# Altium schematic sheet Bumblebee.SchDoc
size 431 x 279 mm; SheetNumber: 1; SheetTotal: 1; ENG_APP_DATE: --/--/--; DSN_APP_DATE: --/--/--; CHK_APP_DATE: --/--/--
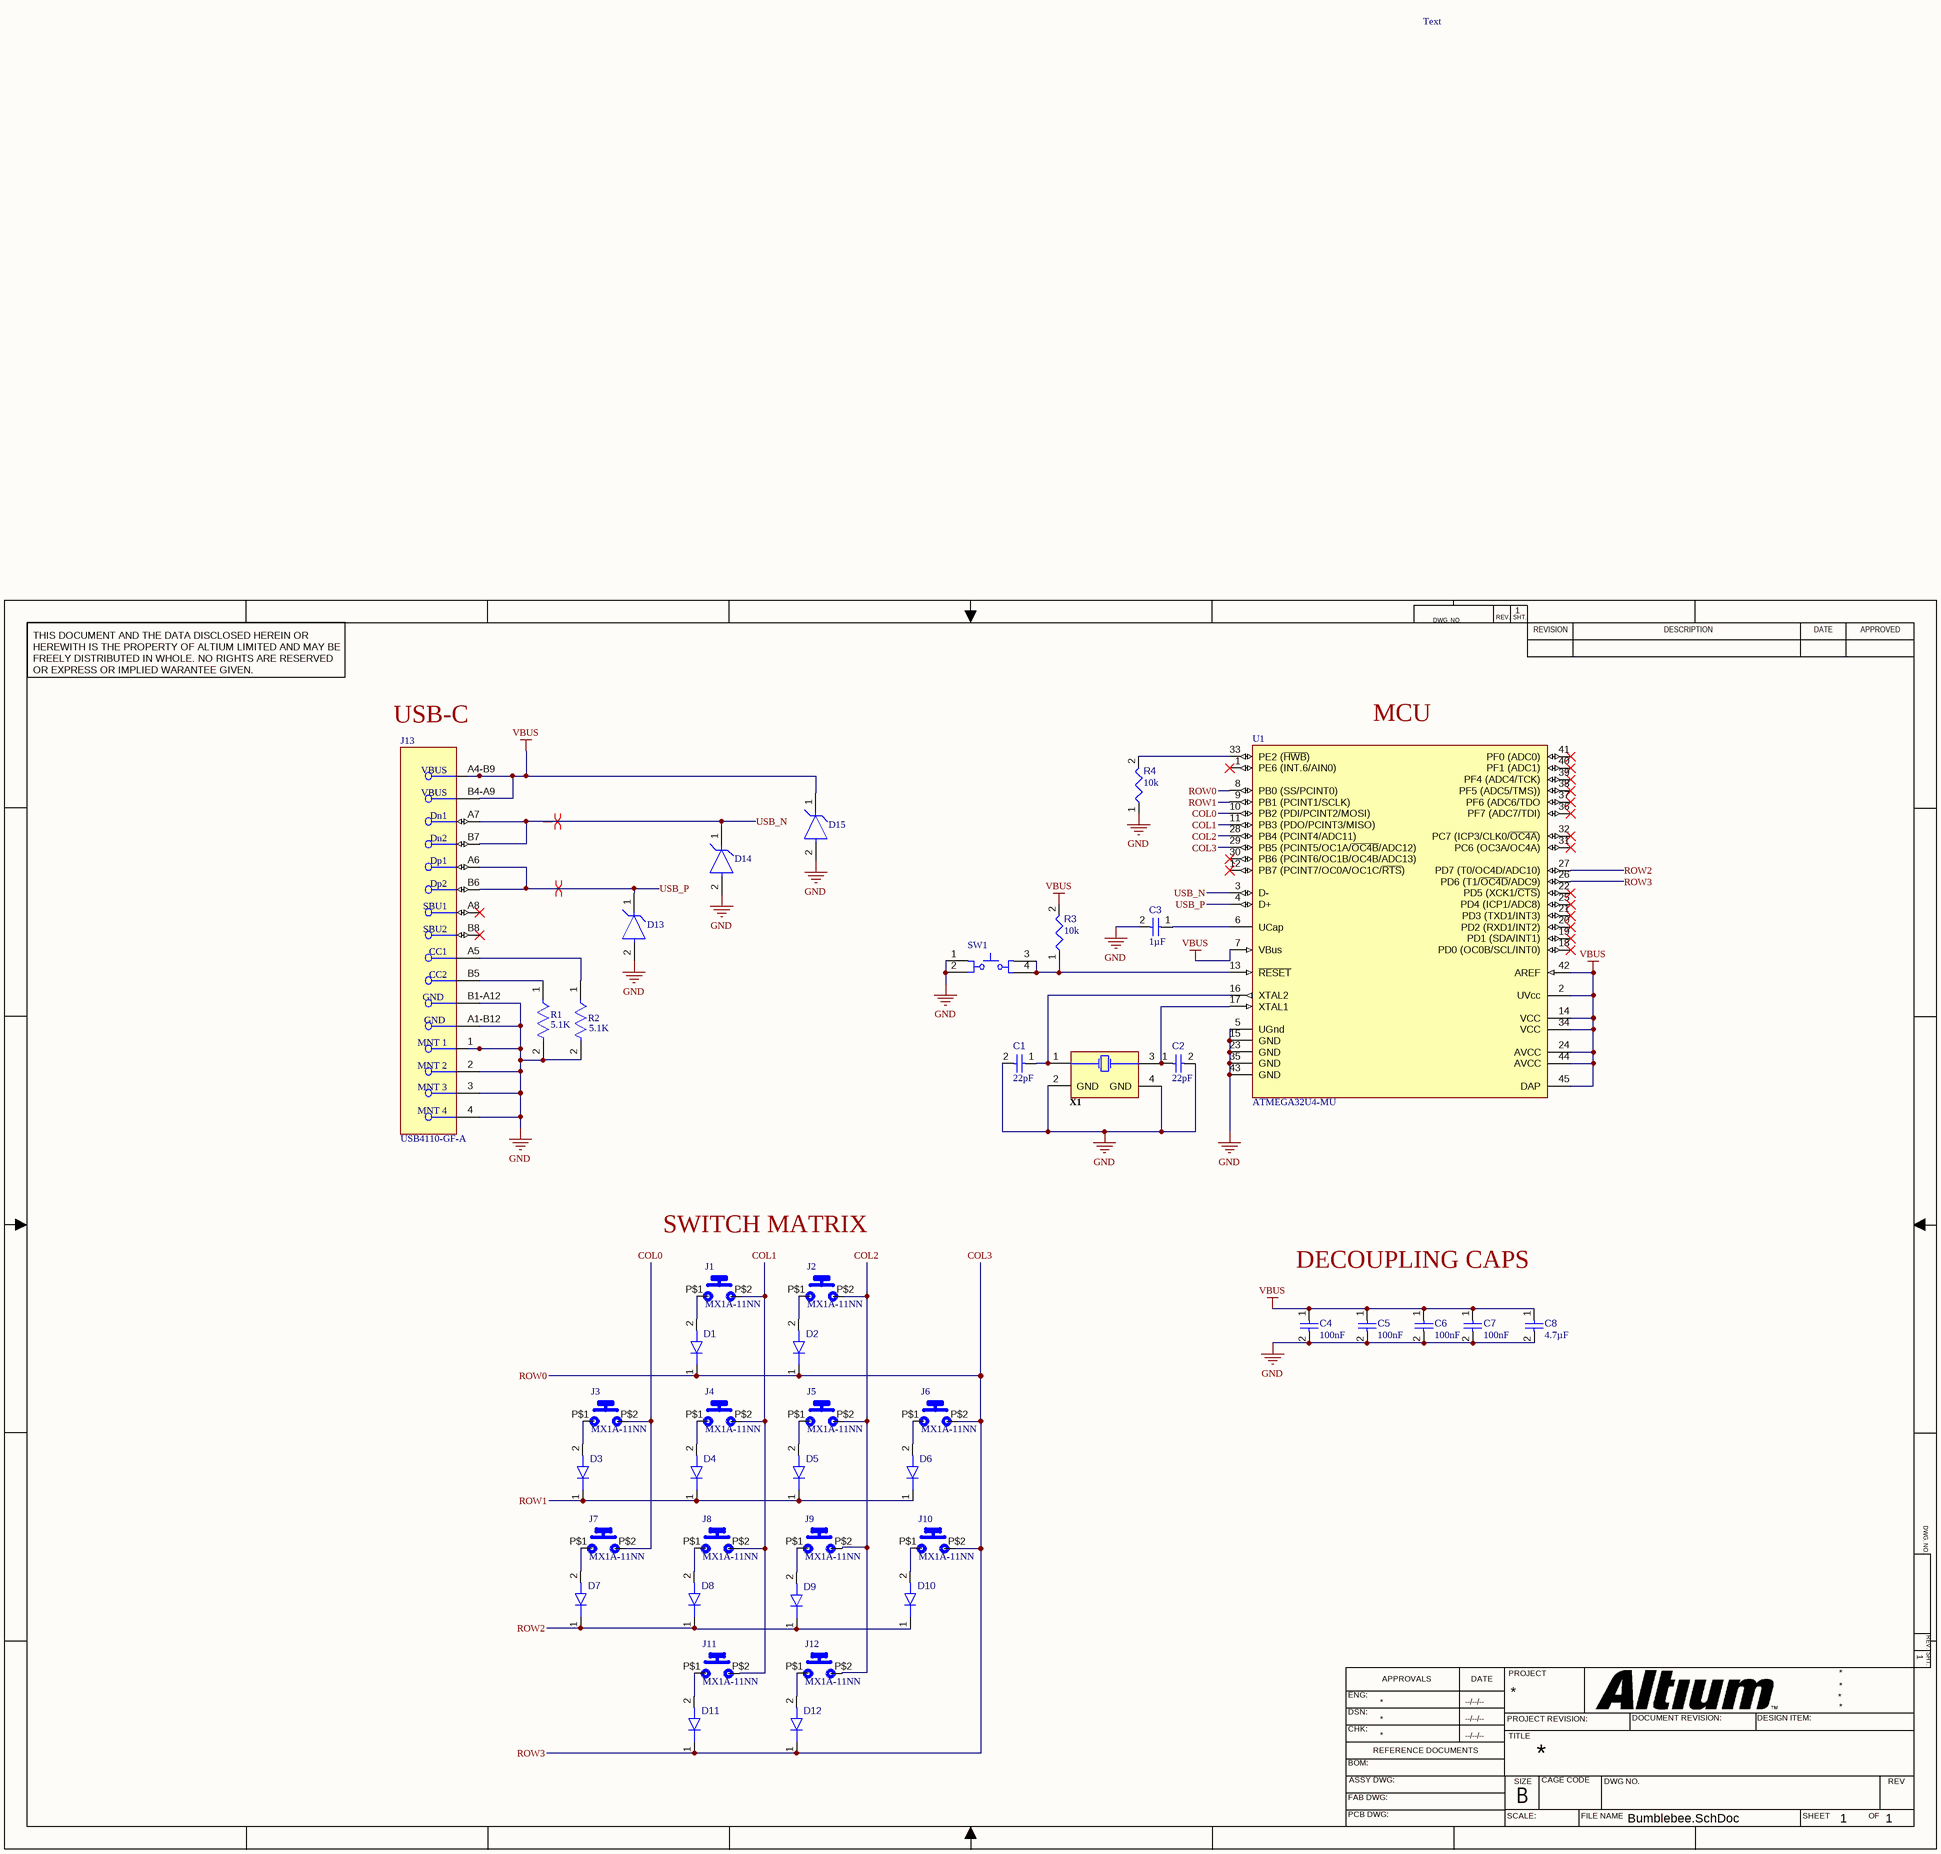
[diagram p0: Bumblebee.SchDoc]

## Parts
C1  value 22pF  [CAPC0402(1005)60_L]  (hidden comment: Capacitor 22pF +/-10% 50V 0402)
C2  value 22pF  [CAPC0402(1005)60_L]  (hidden comment: Capacitor 22pF +/-10% 50V 0402)
C3  value 1µF  [CAPC1005X55X25LL05T10]  (hidden comment: Capacitor 1 uF +/- 10% 6.3 V 0402)
C4  value 100nF  [CAPC1005X56X25LL10T15]  (hidden comment: Capacitor 0.1 uF +/- 5% 16 V 0402)
C5  value 100nF  [CAPC1005X56X25LL10T15]  (hidden comment: Capacitor 0.1 uF +/- 5% 16 V 0402)
C6  value 100nF  [CAPC1005X56X25LL10T15]  (hidden comment: Capacitor 0.1 uF +/- 5% 16 V 0402)
C7  value 100nF  [CAPC1005X56X25LL10T15]  (hidden comment: Capacitor 0.1 uF +/- 5% 16 V 0402)
C8  value 4.7µF  [CAPC0603(1608)100_L]  (hidden comment: Capacitor 4.7µF +/-20% 10V 0603)
D1  1SS400CSFH  [ROHM-VMN2-2_V]  (value not drawn)
D2  1SS400CSFH  [ROHM-VMN2-2_V]  (value not drawn)
D3  1SS400CSFH  [ROHM-VMN2-2_V]  (value not drawn)
D4  1SS400CSFH  [ROHM-VMN2-2_V]  (value not drawn)
D5  1SS400CSFH  [ROHM-VMN2-2_V]  (value not drawn)
D6  1SS400CSFH  [ROHM-VMN2-2_V]  (value not drawn)
D7  1SS400CSFH  [ROHM-VMN2-2_V]  (value not drawn)
D8  1SS400CSFH  [ROHM-VMN2-2_V]  (value not drawn)
D9  1SS400CSFH  [ROHM-VMN2-2_V]  (value not drawn)
D10  1SS400CSFH  [ROHM-VMN2-2_V]  (value not drawn)
D11  1SS400CSFH  [ROHM-VMN2-2_V]  (value not drawn)
D12  1SS400CSFH  [ROHM-VMN2-2_V]  (value not drawn)
D13  CPDU5V0USP-HF  [FP-0603-SOD-523F-MFG]  (value not drawn)
D14  CPDU5V0USP-HF  [FP-0603-SOD-523F-MFG]  (value not drawn)
D15  CPDU5V0USP-HF  [FP-0603-SOD-523F-MFG]  (value not drawn)
J1  MX1A-11NN  [CHERRY_MX1A-11NN_SWITCH]
J2  MX1A-11NN  [CHERRY_MX1A-11NN_SWITCH]
J3  MX1A-11NN  [CHERRY_MX1A-11NN_SWITCH]
J4  MX1A-11NN  [CHERRY_MX1A-11NN_SWITCH]
J5  MX1A-11NN  [CHERRY_MX1A-11NN_SWITCH]
J6  MX1A-11NN  [CHERRY_MX1A-11NN_SWITCH]
J7  MX1A-11NN  [CHERRY_MX1A-11NN_SWITCH]
J8  MX1A-11NN  [CHERRY_MX1A-11NN_SWITCH]
J9  MX1A-11NN  [CHERRY_MX1A-11NN_SWITCH]
J10  MX1A-11NN  [CHERRY_MX1A-11NN_SWITCH]
J11  MX1A-11NN  [CHERRY_MX1A-11NN_SWITCH]
J12  MX1A-11NN  [CHERRY_MX1A-11NN_SWITCH]
J13  USB4110-GF-A  [FP-USB4110-GF-A-MFG]
R1  value 5.1K  [FP-ERA3A-MFG]  (hidden comment: ERA-3AEB512V)
R2  value 5.1K  [FP-ERA3A-MFG]  (hidden comment: ERA-3AEB512V)
R3  value 10k  [RESC0402(1005)_L]  (hidden comment: 10KR2F)
R4  value 10k  [RESC0402(1005)_L]  (hidden comment: 10KR2F)
SW1  TL3342F160QG  [ESWI-TL3342F160QG_V]  (value not drawn)
U1  ATMEGA32U4-MU  [44PW_L]
X1  7B-16.000MAAJ-T  [TXC-7B-4_V]  (value not drawn)

## Nets
GND: C1.2 C2.2 C3.2 C4.2 C5.2 C6.2 C7.2 C8.2 D13.2(A) D14.2(A) D15.2(A) J13.1(MNT_1) J13.2(MNT_2) J13.3(MNT_3) J13.4(MNT_4) J13.A1-B12(GND) J13.B1-A12(GND) R1.2 R2.2 R4.1 SW1.1 SW1.2 U1.5(UGnd) U1.15(GND) U1.23(GND) U1.35(GND) U1.43(GND) X1.2(GND) X1.4(GND)
VBUS: C4.1 C5.1 C6.1 C7.1 C8.1 D15.1(C) J13.A4-B9(VBUS) J13.B4-A9(VBUS) R3.2 U1.2(UVcc) U1.7(VBus) U1.14(VCC) U1.24(AVCC) U1.34(VCC) U1.42(AREF) U1.44(AVCC) U1.45(DAP)
COL0: J3.P$2(S) J7.P$2(S) U1.10(PB2_(PDI/PCINT2/MOSI))
COL1: J1.P$2(S) J4.P$2(S) J8.P$2(S) J11.P$2(S) U1.11(PB3_(PDO/PCINT3/MISO))
COL2: J2.P$2(S) J5.P$2(S) J9.P$2(S) J12.P$2(S) U1.28(PB4_(PCINT4/ADC11))
COL3: D1.1(K) D2.1(K) D11.1(K) D12.1(K) J6.P$2(S) J10.P$2(S) U1.8(PB0_(SS/PCINT0)) U1.26(PD6_(T1/~{OC4D}/ADC9)) U1.29(PB5_(PCINT5/OC1A/~{OC4B}/ADC12))  [also labelled ROW0, ROW3]
ROW1: D3.1(K) D4.1(K) D5.1(K) D6.1(K) U1.9(PB1_(PCINT1/SCLK))
ROW2: D7.1(K) D8.1(K) D9.1(K) D10.1(K) U1.27(PD7_(T0/OC4D/ADC10))
USB_N: D14.1(C) J13.A7(Dn1) J13.B7(Dn2) U1.3(D-)
USB_P: D13.1(C) J13.A6(Dp1) J13.B6(Dp2) U1.4(D+)
NetC1_1: C1.1 U1.16(XTAL2) X1.1(X1)
NetC2_1: C2.1 U1.17(XTAL1) X1.3(X2)
NetC3_1: C3.1 U1.6(UCap)
NetD1_2: D1.2(A) J1.P$1(P)
NetD2_2: D2.2(A) J2.P$1(P)
NetD3_2: D3.2(A) J3.P$1(P)
NetD4_2: D4.2(A) J4.P$1(P)
NetD5_2: D5.2(A) J5.P$1(P)
NetD6_2: D6.2(A) J6.P$1(P)
NetD7_2: D7.2(A) J7.P$1(P)
NetD8_2: D8.2(A) J8.P$1(P)
NetD9_2: D9.2(A) J9.P$1(P)
NetD10_2: D10.2(A) J10.P$1(P)
NetD11_2: D11.2(A) J11.P$1(P)
NetD12_2: D12.2(A) J12.P$1(P)
NetJ13_A5: J13.A5(CC1) R2.1
NetJ13_B5: J13.B5(CC2) R1.1
NetR3_1: R3.1 SW1.3 SW1.4 U1.13(~{RESET})
NetR4_2: R4.2 U1.33(PE2_(~{HWB}))

Not connected (* = marked no-connect by the designer): J13 A8(SBU1)* B8(SBU2)*; U1 1(PE6_(INT.6/AIN0))* 12(PB7_(PCINT7/OC0A/OC1C/~{RTS}))* 18(PD0_(OC0B/SCL/INT0))* 19(PD1_(SDA/INT1))* 20(PD2_(RXD1/INT2))* 21(PD3_(TXD1/INT3))* 22(PD5_(XCK1/~{CTS}))* 25(PD4_(ICP1/ADC8))* 30(PB6_(PCINT6/OC1B/OC4B/ADC13))* 31(PC6_(OC3A/OC4A))* 32(PC7_(ICP3/CLK0/~{OC4A}))* 36(PF7_(ADC7/TDI))* 37(PF6_(ADC6/TDO)* 38(PF5_(ADC5/TMS)))* 39(PF4_(ADC4/TCK))* 40(PF1_(ADC1))* 41(PF0_(ADC0))*

## Layout directives
differential pair: USB_N, USB_P

## Notes on the sheet
- Text
- USB-C
- (near U1) MCU
- SWITCH MATRIX
- DECOUPLING CAPS
- DWG. NO.
- REV.
- SHT.
- THIS DOCUMENT AND THE DATA DISCLOSED HEREIN OR HEREWITH IS THE PROPERTY OF ALTIUM LIMITED AND MAY BE FREELY DISTRIBUTED IN WHOLE. NO RIGHTS ARE RESERVED OR EXPRESS OR IMPLIED WARANTEE GIVEN.
- REVISION
- DESCRIPTION
- DATE
- APPROVED
- ENG:
- APPROVALS
- PROJECT
- DSN:
- CHK:
- REFERENCE DOCUMENTS
- PROJECT REVISION:
- TITLE
- DOCUMENT REVISION:
- DESIGN ITEM:
- BOM:
- FAB DWG:
- PCB DWG:
- ASSY DWG:
- SCALE:
- SIZE
- B
- CAGE CODE
- FILE NAME
- DWG NO.
- SHEET
- OF
- REV

## Library data of the parts
C1 C2 = CMP-001-00073-3: Chip Capacitor, 22pF +/-10%, 50V, 0402, Thickness 0.6 mm; Tolerance: 10%; Pins: 2; Voltage Rating: 50V; Max Operating Temperature: 85°C; Min Operating Temperature: -55°C; Mounting Technology: SMT; Case/Package: 0402
C3 = CMP-001-00008-6: Chip Capacitor, 1 uF, +/- 10%, 6.3 V, 0402 (1005 Metric); Capacitor Type: Ceramic; Voltage Rating: 6.3V; Max Operating Temperature: 85°C; Mounting Technology: SM; Tolerance: 10%; Case/Package: 0402; RoHS Compliant: True; Min Operating Temperature: -55°C; Pins: 2
C4-C7 = CMP-001-00001-6: Chip Capacitor, 0.1 uF, +/- 5%, 16 V, 0402 (1005 Metric); Capacitor Type: Ceramic; Voltage Rating: 16V; Max Operating Temperature: 125°C; Min Operating Temperature: -55°C; Case/Package: 0402; Mounting Technology: SM; Pins: 2; Tolerance: 5%; RoHS Compliant: True
C8 = CMP-001-00076-4: Chip Capacitor, 4.7µF +/-20%, 10V, 0603, Thickness 1 mm; Tolerance: 10%; Mounting Technology: SMT; Case/Package: 0603; Pins: 2; Min Operating Temperature: -55°C; Max Operating Temperature: 85°C; Voltage Rating: 10V
D1-D12 = CMP-004-00022-3: Switching Diode (High Speed Switching), 80 V, 100 mA, 2-Pin SOD-923, RoHS, Tape and Reel; Pins: 2; Mounting Technology: SMT
D13-D15 = CMP-004-00031-1: Tvs Diode 5V 25V 0603/SOD523F
J1-J12 = CMP-003-000001-3: Pushbutton Switch SPST-NO Keyswitch Panel Mount, Front; MF: Cherry; Component Type: Standard; Package: None; Design Item ID: MX1A-11NN; Pin Count: 2; MP: MX1A-11NN
J13 = CMP-002-00073-4: Conn USB Type C RCP 16 POS 0.3mm/0.5mm Solder ST SMD 16 Terminal 1 Port T/R
R1 R2 = CMP-009-00177-1: Res Thin Film 0603 5.1K Ohm 0.1% 1/10W ±25ppm/°C Molded SMD SMD Punched Carrier T/R
R3 R4 = CMP-009-00066-2: 10K 0.063W 1% 0402 (1005 Metric)  SMD; Power: 63mW; Case/Package: 0402; Mounting Technology: SMT; Pins: 2; Tolerance: 1%
SW1 = CMP-011-00008-2: Tactile Switch, SPST-NO, 50 mA, 12 V, 4-Pin SMD, RoHS, Tape and Reel; Manufacturer: E-Switch; Operating Force: 1.6N; Current Rating: 50mA; Throw Configuration: SPST; Max Voltage Rating (DC): 12V; Datasheet URL: http://spec_sheets.e-switch.com/specs/P010632.pdf; Manufacturer URL: http://www.e-switch.ch/en/; Mounting Technology: SM; Case/Package: TL3342F160QG; Package Quantity: 3000; Contact Material: Silver; Package Description: 4-Pin Surface Mount Device, Body 5 x 5 mm, Pitch 6.3 mm; Package Reference: TL3342F160QG; Datasheet Version: Rev. I, 12/2010; Voltage Rating (DC): 12V; Contact Plating: Silver; RoHS Compliant: True; Packaging: TapeandReel
U1 = CMP-020-00023-1: 8-bit AVR MCU, 32 KB, 2560 Bytes, 16 MHz, 2.7 to 5.5V, VQFN-44, RoHS; Number of UART Channels: 1; Pins: 44
X1 = CMP-003-00009-2: SMD Seam Sealing Crystal, 16 MHz, +/- 30 ppm, 18 pF, -10 to 70 degC, 4-Pin SMD, RoHS, Tape and Reel; Manufacturer: TXC; ESR: 40; Resistance: 40Ohm; Frequency: 16MHz; Tolerance: 30ppm; Load Capacitance: 18pF; Datasheet Version: Jul-15; Datasheet URL: http://www.txccorp.com/download/products/quartz_crystals/2015TXC_7B_19.pdf; Min Operating Temperature: -10°C; Case/Package: 7B-4; Package Description: 4-Pin Surface Mount Device, Body 5 x 3.2 mm, Pitch 3.7 mm; RoHS Compliant: True; Mounting Technology: SM; Max Operating Temperature: 70°C; Package Reference: 7B-4; Package Quantity: 1000; Packaging: TapeandReel; Pins: 4; Frequency Tolerance: 30ppm